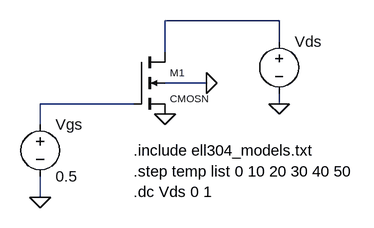
[diagram p0: schematic exmp1.asc]
exmp1.asc, the LTspice schematic file:
Version 4
SHEET 1 880 680
WIRE 400 64 224 64
WIRE 400 96 400 64
WIRE 224 112 224 64
WIRE 288 160 224 160
WIRE 176 192 32 192
WIRE 400 192 400 176
WIRE 32 224 32 192
WIRE 32 336 32 304
FLAG 288 160 0
FLAG 224 208 0
FLAG 400 192 0
FLAG 32 336 0
SYMBOL nmos4 176 112 R0
WINDOW 0 56 32 Left 1
WINDOW 3 56 72 Left 1
SYMATTR InstName M1
SYMATTR Value CMOSN
SYMATTR Value2 l=0.18u w=1u
SYMBOL voltage 400 80 R0
SYMATTR InstName Vds
SYMATTR Value ""
SYMBOL voltage 32 208 R0
WINDOW 123 0 0 Left 0
WINDOW 39 0 0 Left 0
SYMATTR InstName Vgs
SYMATTR Value 0.5
TEXT 176 264 Left 2 !.include ell304_models.txt
TEXT 176 296 Left 2 !.step temp list 0 10 20 30 40 50
TEXT 176 328 Left 2 !.dc Vds 0 1

The netlist it stands for:
* exmp1.asc
M1 N001 N002 0 0 CMOSN l=0.18u w=1u
Vds N001 0
Vgs N002 0 0.5
.model NMOS NMOS
.model PMOS PMOS
.lib standard.mos
.include ell304_models.txt
.step temp list 0 10 20 30 40 50
.dc Vds 0 1
.backanno
.end